# EAGLE design pressure_flow (EAGLE 7.6.0)
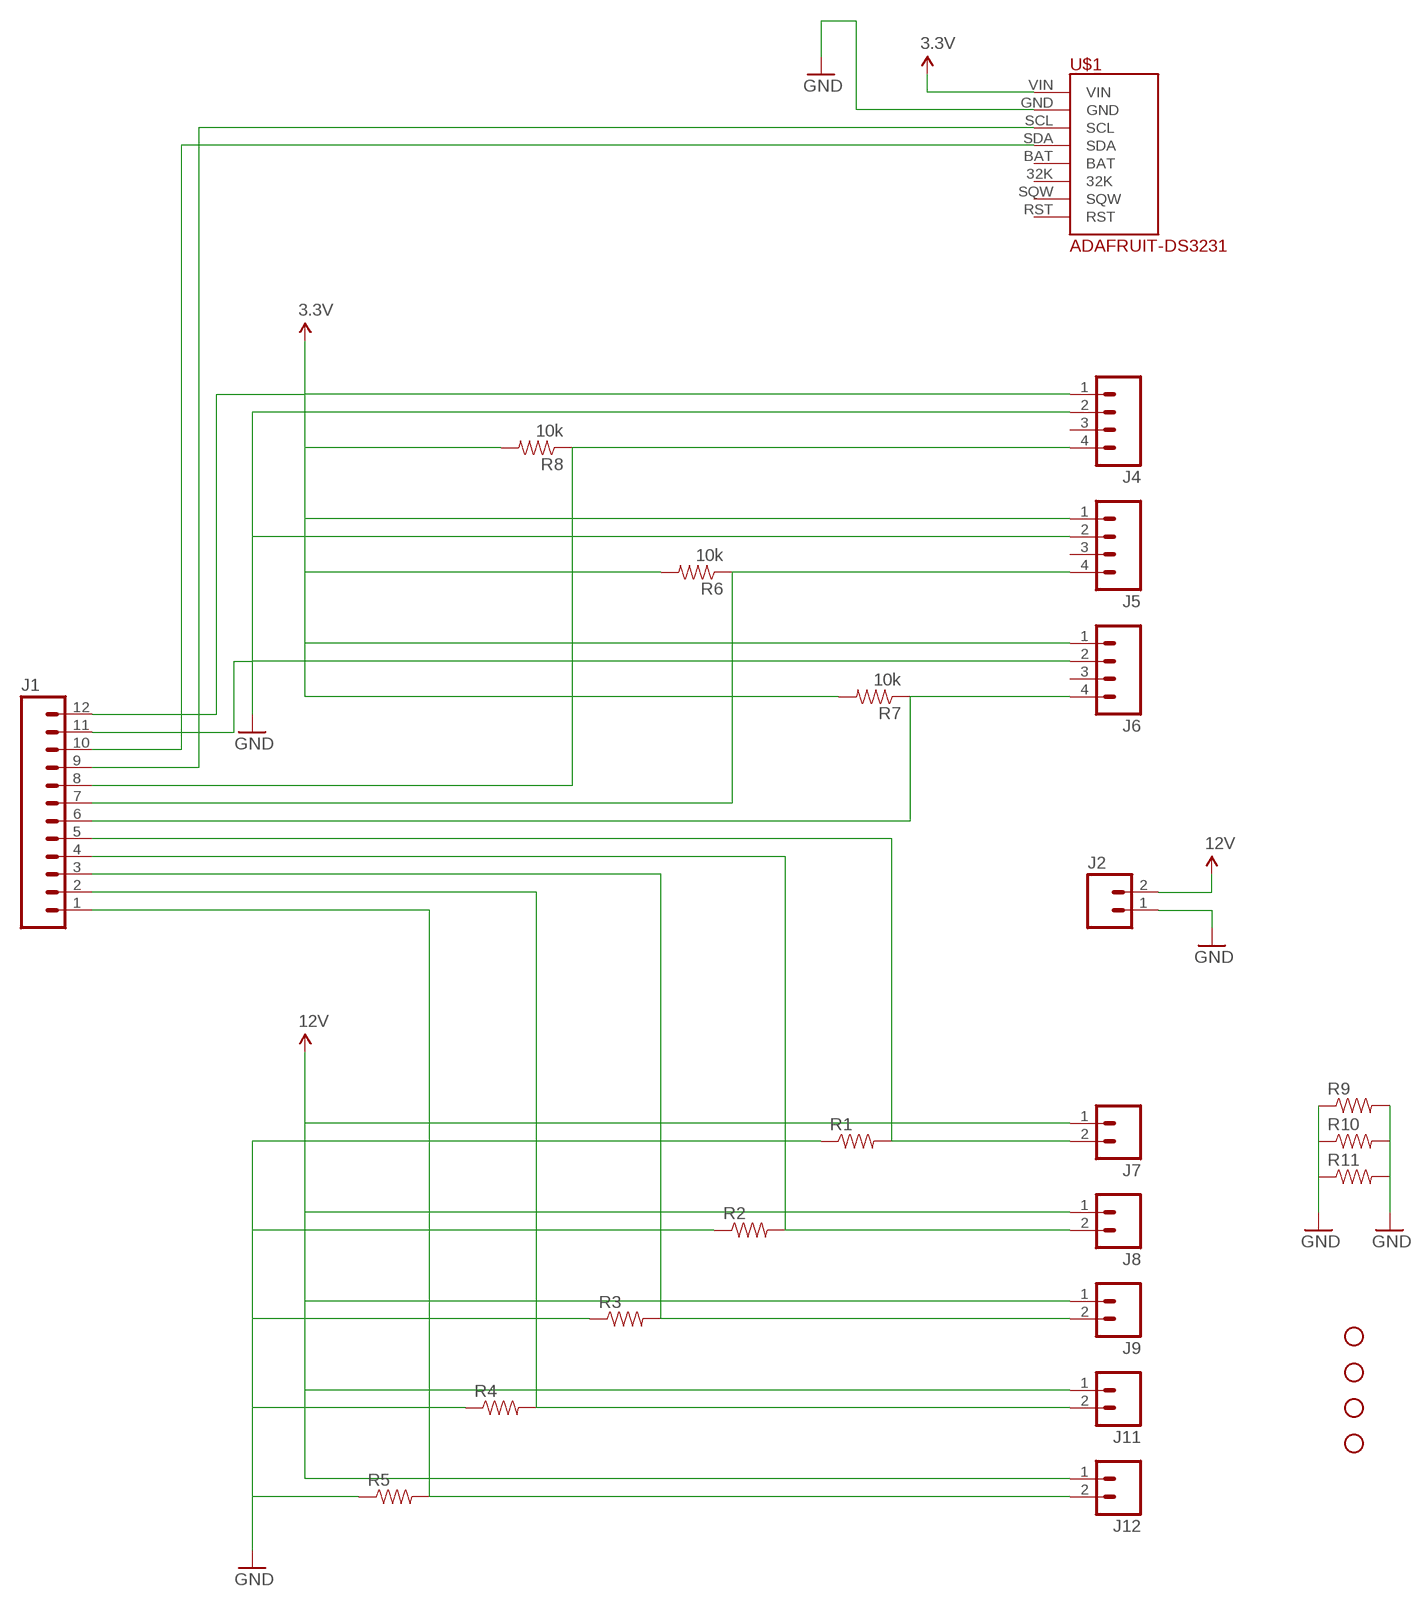
[diagram p0: schematic, sheet 1]

## Parts
H1  STAND-OFF  [STAND-OFF]
H2  STAND-OFF  [STAND-OFF]
H3  STAND-OFF  [STAND-OFF]
H4  STAND-OFF  [STAND-OFF]
J1  M12LOCK_LONGPADS  [1X12_LOCK_LONGPADS]
J2  M02LOCK_LONGPADS  [1X02_LOCK_LONGPADS]
J4  M04LOCK_LONGPADS  [1X04_LOCK_LONGPADS]
J5  M04LOCK_LONGPADS  [1X04_LOCK_LONGPADS]
J6  M04LOCK_LONGPADS  [1X04_LOCK_LONGPADS]
J7  M02LOCK_LONGPADS  [1X02_LOCK_LONGPADS]
J8  M02LOCK_LONGPADS  [1X02_LOCK_LONGPADS]
J9  M02LOCK_LONGPADS  [1X02_LOCK_LONGPADS]
J11  M02LOCK_LONGPADS  [1X02_LOCK_LONGPADS]
J12  M02LOCK_LONGPADS  [1X02_LOCK_LONGPADS]
R1  RESISTORPTH-1/2W  [AXIAL-0.5]
R2  RESISTORPTH-1/2W  [AXIAL-0.5]
R3  RESISTORPTH-1/2W  [AXIAL-0.5]
R4  RESISTORPTH-1/2W  [AXIAL-0.5]
R5  RESISTORPTH-1/2W  [AXIAL-0.5]
R6  10k  10KOHM-1/4W-1%(PTH)HORIZ  [AXIAL-0.3]
R7  10k  10KOHM-1/4W-1%(PTH)HORIZ  [AXIAL-0.3]
R8  10k  10KOHM-1/4W-1%(PTH)HORIZ  [AXIAL-0.3]
R9  RESISTORPTH-1/2W  [AXIAL-0.5]
R10  RESISTORPTH-1/2W  [AXIAL-0.5]
R11  RESISTORPTH-1/2W  [AXIAL-0.5]
U$1  ADAFRUIT-DS3231  [ADAFRUIT-DS3231]

## Nets
3.3V: J1.12 J4.1 J5.1 J6.1 R6.P$2 R7.P$2 R8.P$2 U$1.VIN
12V: J2.2 J7.1 J8.1 J9.1 J11.1 J12.1
GND: J1.11 J2.1 J4.2 J5.2 J6.2 R1.P$1 R2.P$1 R3.P$1 R4.P$1 R5.P$1 R9.P$1 R9.P$2 R10.P$1 R10.P$2 R11.P$1 R11.P$2 U$1.GND
N$1: J1.5 J7.2 R1.P$2
N$2: J1.4 J8.2 R2.P$2
N$3: J1.2 J11.2 R4.P$2
N$4: J1.1 J12.2 R5.P$2
N$5: J1.9 U$1.SCL
N$6: J1.6 J6.4 R7.P$1
N$7: J1.8 J4.4 R8.P$1
N$8: J1.7 J5.4 R6.P$1
N$9: J1.10 U$1.SDA
N$10: J1.3 J9.2 R3.P$2
Unconnected: J4.3 J5.3 J6.3 U$1.32K U$1.BAT U$1.RST U$1.SQW

## Library data of the parts
H1-H4 = SparkFun-Electromechanical:STAND-OFF: #4 Stand Off This is the mechanical footprint for a #4 phillips button head screw. Use the keepout ring to avoid running the screw head into surrounding components. SKU : PRT-00447
J1 = SparkFun-Connectors:M12: Header 12 Standard 12-pin 0.1" header. Use with straight break away headers (SKU : PRT-00116), right angle break away headers (PRT-00553), swiss pins (PRT-00743), machine pins (PRT-00117), and female headers (PRT-00115).
J2 J7-J9 J11 J12 = SparkFun-Connectors:M02: Standard 2-pin 0.1" header. Use with - straight break away headers ( PRT-00116) - right angle break away headers (PRT-00553) - swiss pins (PRT-00743) - machine pins (PRT-00117) - female headers (PRT-00115) Molex polarized connector foot print use with: PRT-08233 with associated crimp pins and housings. 2.54_SCREWTERM for use with PRT-10571. 3.5mm Screw Terminal footprints for PRT-08084 5mm Screw Terminal footprints for use with PRT-08432
J4-J6 = SparkFun-Connectors:M04: Header 4 Standard 4-pin 0.1" header. Use with straight break away headers (SKU : PRT-00116), right angle break away headers (PRT-00553), swiss pins (PRT-00743), machine pins (PRT-00117), and female headers (PRT-00115). Molex polarized connector foot print use with SKU : PRT-08231 with associated crimp pins and housings. 1MM SMD Version SKU: PRT-10208; PROD_ID: CONN-09696
R1-R5 R9-R11 = SparkFun-Passives:RESISTOR: Resistor Basic schematic elements and footprints for 0603, 1206, and PTH resistors.
R6-R8 = SparkFun-Resistors:10KOHM-1/4W-1%(PTH): RES-12183; PROD_ID: RES-12183
U$1 = dotson:ADAFRUIT-DS3231

## Board
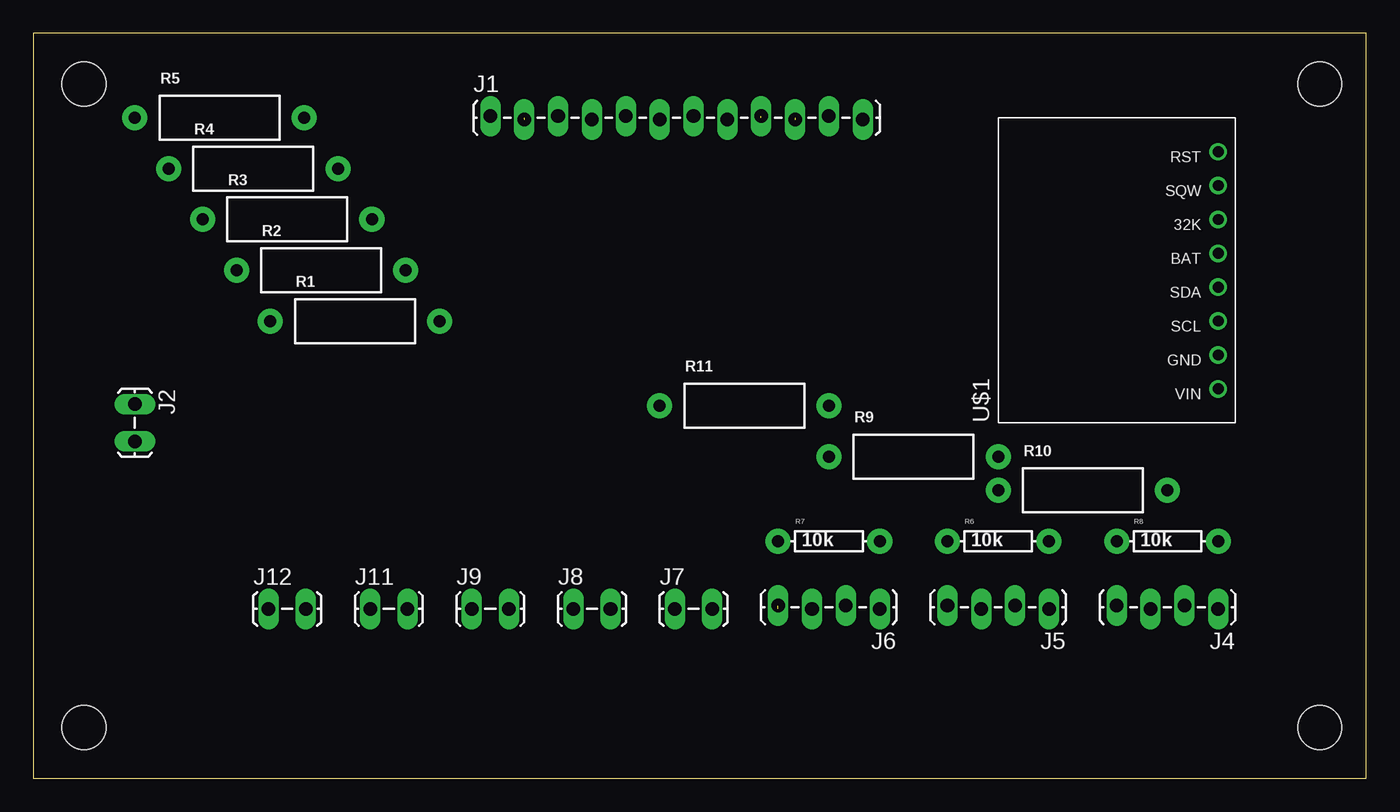
[diagram p1: board, top side]
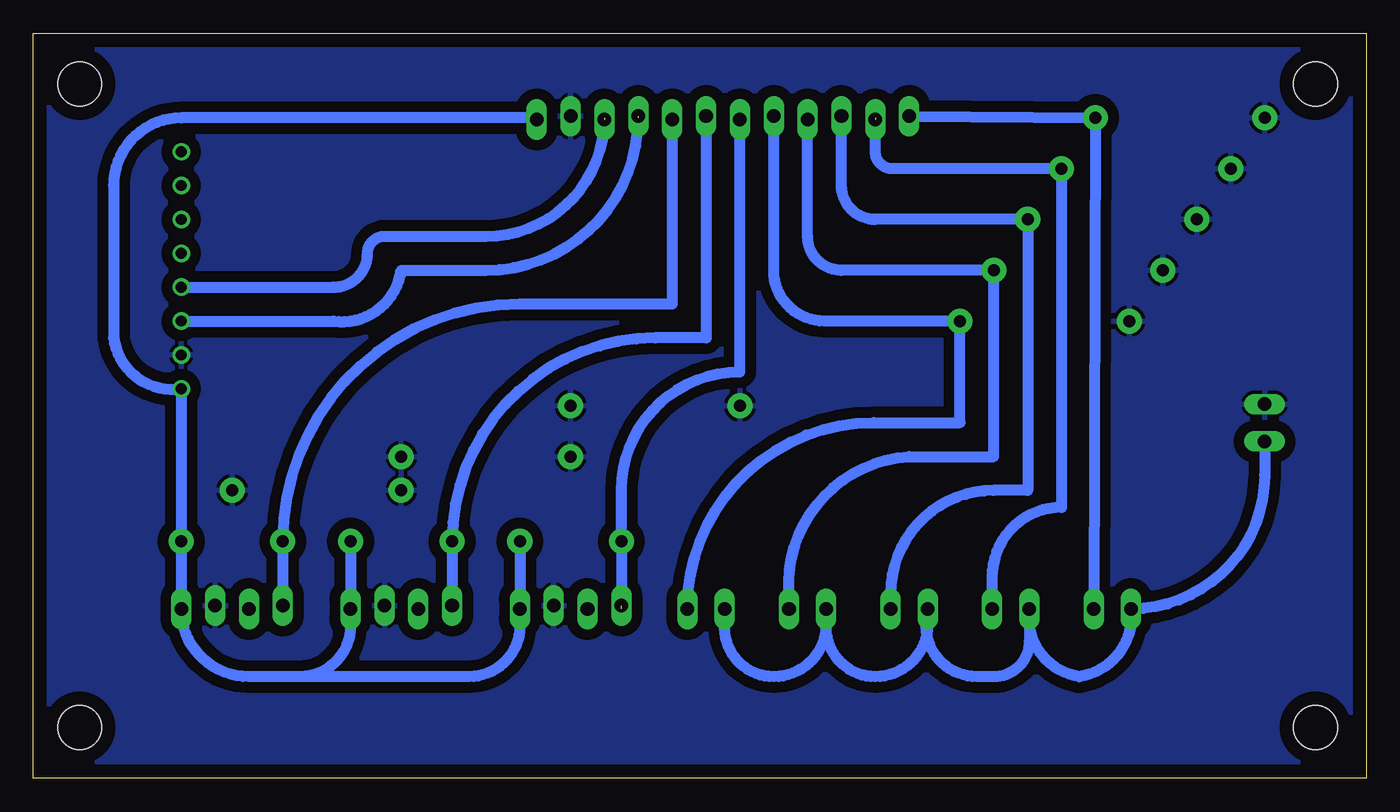
[diagram p2: board, bottom side, seen from below]

Size 100 x 55.87 mm. Coordinates in mm from the lower left corner, seen from the top.
Outline: 0,0 100,0 100,55.87 0,55.87 0,0
Copper layers (1*16): Top 0.035mm / dielectric 1.5mm / Bottom 0.035mm
Design rules "default *": minimum track width 10mil, minimum drill 24mil, track to track 32mil, track to pad 32mil, pad to pad 32mil, via to via 32mil, smd to smd 8mil, copper to edge 40mil, drill to drill 8mil, minimum pad ring 10mil, minimum via ring 8mil, stop-mask expansion 4mil, vias tented up to drill 0mil, thermal gap 10mil

### Footprints (pad centres in the part's own frame; a part is rotated, then mirrored left to right if it is on the bottom)
STAND-OFF = hole 3.302: 0,0
1X12_LOCK_LONGPADS = drill 1.016 long: 1 0,0.127; 2 2.54,-0.127; 3 5.08,0.127; 4 7.62,-0.127; 5 10.16,0.127; 6 12.7,-0.127; 7 15.24,0.127; 8 17.78,-0.127; 9 20.32,0.127; 10 22.86,-0.127; 11 25.4,0.127; 12 27.94,-0.127
1X02_LOCK_LONGPADS = drill 1.016 long: 1 -0.127,0; 2 2.667,0
1X04_LOCK_LONGPADS = drill 1.016 long: 1 0,0; 2 2.54,-0.254; 3 5.08,0; 4 7.62,-0.254
AXIAL-0.5 = drill 0.9 pad 1.88: P$1 -6.35,0; P$2 6.35,0
AXIAL-0.3 = drill 0.9 pad 1.88: P$1 -3.81,0; P$2 3.81,0
ADAFRUIT-DS3231 = drill 0.8: 32K 15.24,1.27; BAT 12.7,1.27; GND 5.08,1.27; RST 20.32,1.27; SCL 7.62,1.27; SDA 10.16,1.27; SQW 17.78,1.27; VIN 2.54,1.27

### Placement (x,y rotation side)
H1  3.81,3.81 0 top
H2  96.52,3.81 0 top
H3  3.81,52.07 0 top
H4  96.52,52.07 0 top
J1  34.29,49.53 0 top
J2  7.62,27.94 270 top
J4  88.9,12.7 180 top
J5  76.2,12.7 180 top
J6  63.5,12.7 180 top
J7  48.26,12.7 0 top
J8  40.64,12.7 0 top
J9  33.02,12.7 0 top
J11  25.4,12.7 0 top
J12  17.78,12.7 0 top
R1  24.13,34.29 0 top
R2  21.59,38.1 0 top
R3  19.05,41.91 0 top
R4  16.51,45.72 0 top
R5  13.97,49.53 0 top
R6  72.39,17.78 0 top
R7  59.69,17.78 0 top
R8  85.09,17.78 0 top
R9  66.04,24.13 0 top
R10  78.74,21.59 0 top
R11  53.34,27.94 0 top
U$1  90.17,26.67 90 top

### Tracks (layer width: path | path; a pad name or v marks a point on that pad's centre or on a via)
3.3V
  Bottom 0.813: J1.12 arc-90 62.36,49.53 88.9,49.53 arc-90 93.98,44.45 93.98,33.02 arc-90 U$1.VIN R8.P$2 J4.1 | 80.01,7.62 arc-90 76.2,11.43 J5.1 R6.P$2 | 80.01,7.62 83.82,7.62 | 83.82,7.62 arc90 J4.1 | 80.01,7.62 67.31,7.62 arc-90 63.5,11.43 J6.1 R7.P$2 | 83.82,7.62 arc90 J4.1
12V
  Bottom 0.813: J2.2 7.62,22.73 arc90 J12.1 17.65,12.83 arc90 21.59,7.62 21.46,7.62 arc90 J11.1 25.27,10.29 arc90 27.94,7.62 29.21,7.62 arc90 33.02,11.43 33.02,12.57 arc90 J9.1 32.89,11.56 arc90 36.83,7.62 arc90 40.51,11.3 J8.1 40.51,11.56 arc90 44.45,7.62 arc90 48.13,11.3 J7.1
GND
  pour Bottom: 0,55.88 100.33,55.88 100.33,0 0,0
N$1
  Bottom 0.813: J7.2 arc90 36.96,26.67 30.48,26.67 R1.P$2 40.64,34.29 arc90 44.45,38.1 J1.5
N$2
  Bottom 0.813: J8.2 43.31,13.84 arc90 34.29,24.13 27.94,24.13 R2.P$2 39.37,38.1 arc90 41.91,40.64 J1.4
N$3  (1 unrouted)
  Bottom 0.813: 36.83,49.53 36.83,46.99 arc-90 35.56,45.72 R4.P$2 22.86,20.32 arc-90 28.07,15.11 J11.2
N$4
  Bottom 0.813: J12.2 R5.P$2 J1.1
N$5  (1 unrouted)
  Bottom 0.813: U$1.SCL 77.47,34.29 arc-90 72.39,38.1 66.04,38.1 arc-90 54.61,49.53
N$6  (1 unrouted)
  Bottom 0.813: 55.88,12.7 R7.P$1 55.88,21.59 arc90 46.99,30.48 J1.6
N$7
  Bottom 0.813: J4.4 R8.P$1 arc90 63.5,35.56 52.07,35.56 J1.8
N$8
  Bottom 0.813: J5.4 R6.P$1 arc90 53.34,33.02 49.53,33.02 J1.7
N$9  (1 unrouted)
  Bottom 0.813: U$1.SDA 77.47,36.83 arc-90 74.93,39.37 arc90 73.66,40.64 66.04,40.64 arc-90 57.15,49.53
N$10
  Bottom 0.813: J1.3 39.37,44.45 arc-90 36.83,41.91 R3.P$2 25.4,21.59 27.94,21.59 arc-90 35.69,13.84 J9.2